# EAGLE design main_new_layout (EAGLE 9.6.2)
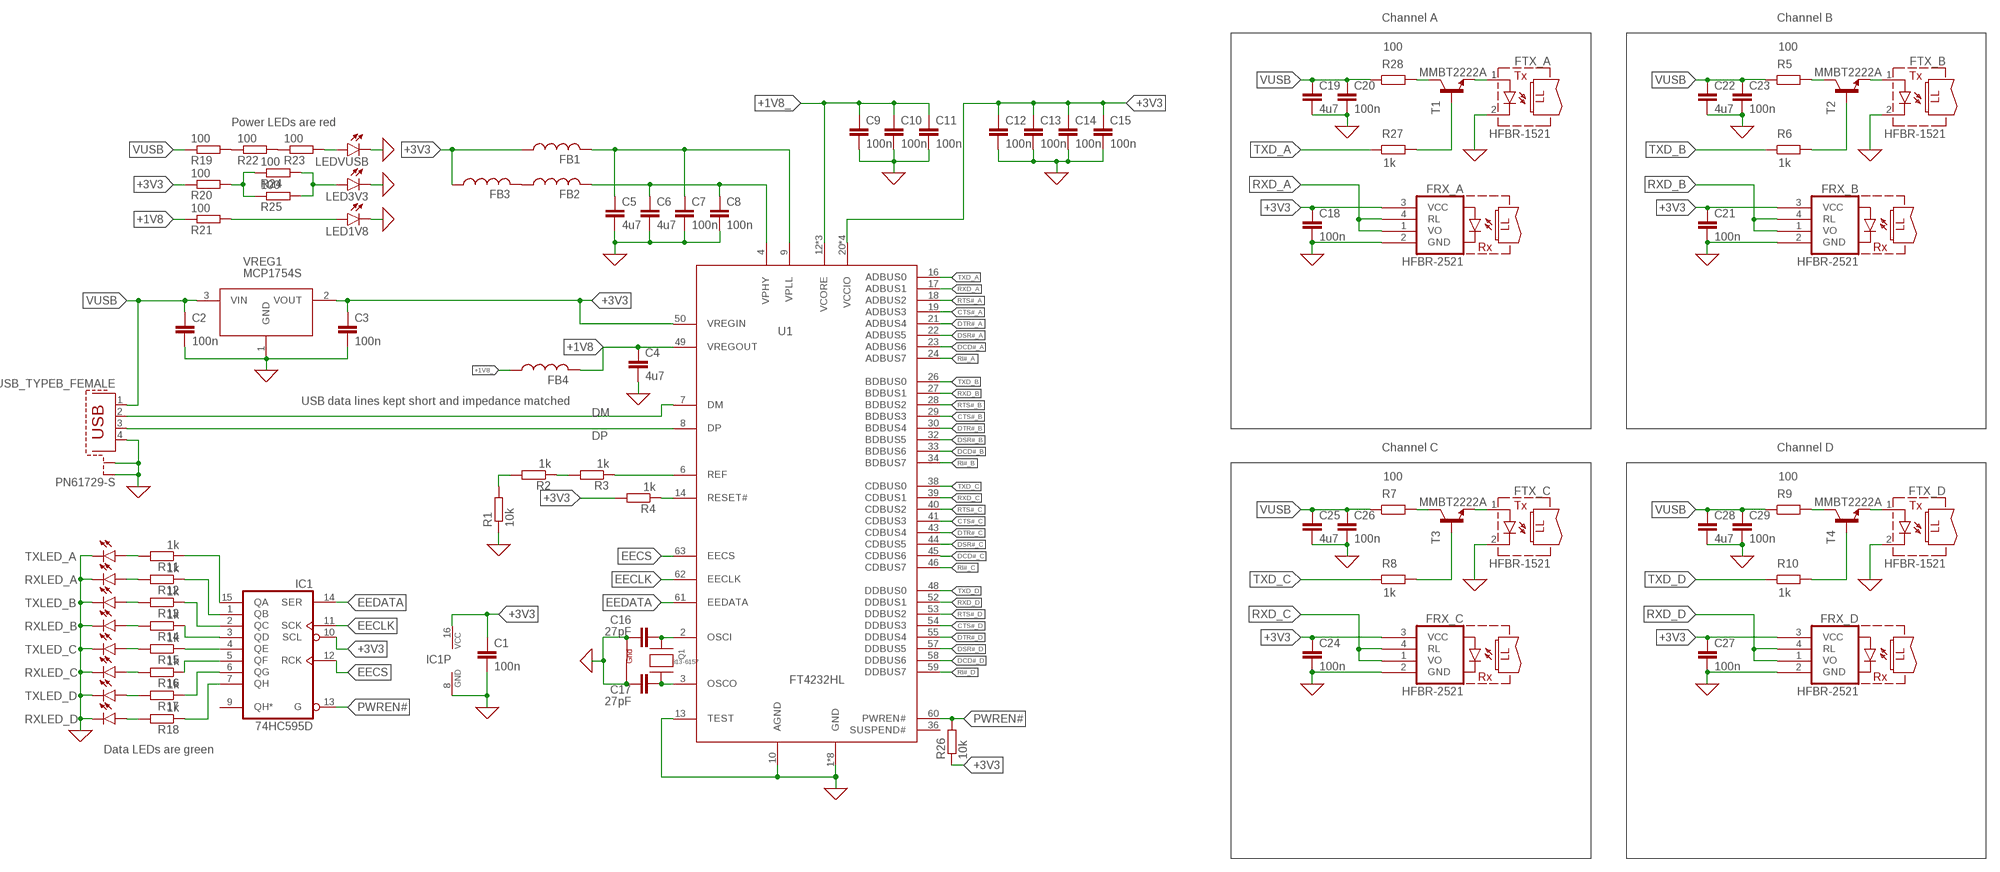
[diagram p0: schematic, sheet 1]

## Parts
C1  100n  C-EUC0805  [C0805]
C2  100n  C-EUC0805  [C0805]
C3  100n  C-EUC0805  [C0805]
C4  4u7  C-EUC0805  [C0805]
C5  4u7  C-EUC0805  [C0805]
C6  4u7  C-EUC0805  [C0805]
C7  100n  C-EUC0805  [C0805]
C8  100n  C-EUC0805  [C0805]
C9  100n  C-EUC0805  [C0805]
C10  100n  C-EUC0805  [C0805]
C11  100n  C-EUC0805  [C0805]
C12  100n  C-EUC0805  [C0805]
C13  100n  C-EUC0805  [C0805]
C14  100n  C-EUC0805  [C0805]
C15  100n  C-EUC0805  [C0805]
C16  27pF  C-EUC0805  [C0805]
C17  27pF  C-EUC0805  [C0805]
C18  100n  C-EUC0805  [C0805]
C19  4u7  C-EUC0805  [C0805]
C20  100n  C-EUC0805  [C0805]
C21  100n  C-EUC0805  [C0805]
C22  4u7  C-EUC0805  [C0805]
C23  100n  C-EUC0805  [C0805]
C24  100n  C-EUC0805  [C0805]
C25  4u7  C-EUC0805  [C0805]
C26  100n  C-EUC0805  [C0805]
C27  100n  C-EUC0805  [C0805]
C28  4u7  C-EUC0805  [C0805]
C29  100n  C-EUC0805  [C0805]
FB1  FERRITE  [R0805]
FB2  FERRITE  [R0805]
FB3  FERRITE  [R0805]
FB4  FERRITE  [R0805]
FRX_A  HFBR-2521  [HFBR-15X3]
FRX_B  HFBR-2521  [HFBR-15X3]
FRX_C  HFBR-2521  [HFBR-15X3]
FRX_D  HFBR-2521  [HFBR-15X3]
FTX_A  HFBR-1521  [HFBR-15X3]
FTX_B  HFBR-1521  [HFBR-15X3]
FTX_C  HFBR-1521  [HFBR-15X3]
FTX_D  HFBR-1521  [HFBR-15X3]
IC1  74HC595D  [SO16]
LED1V8  LEDCHIP-LED0805  [CHIP-LED0805]
LED3V3  LEDCHIP-LED0805  [CHIP-LED0805]
LEDVUSB  LEDCHIP-LED0805  [CHIP-LED0805]
Q1  XTAL-4-3225  [NX3225]
R1  10k  R-EU_R0805  [R0805]
R2  1k  R-EU_R0805  [R0805]
R3  1k  R-EU_R0805  [R0805]
R4  1k  R-EU_R0805  [R0805]
R5  100  R-EU_R0805  [R0805]
R6  1k  R-EU_R0805  [R0805]
R7  100  R-EU_R0805  [R0805]
R8  1k  R-EU_R0805  [R0805]
R9  100  R-EU_R0805  [R0805]
R10  1k  R-EU_R0805  [R0805]
R11  1k  R-EU_R0805  [R0805]
R12  1k  R-EU_R0805  [R0805]
R13  1k  R-EU_R0805  [R0805]
R14  1k  R-EU_R0805  [R0805]
R15  1k  R-EU_R0805  [R0805]
R16  1k  R-EU_R0805  [R0805]
R17  1k  R-EU_R0805  [R0805]
R18  1k  R-EU_R0805  [R0805]
R19  100  R-EU_R0805  [R0805]
R20  100  R-EU_R0805  [R0805]
R21  100  R-EU_R0805  [R0805]
R22  100  R-EU_R0805  [R0805]
R23  100  R-EU_R0805  [R0805]
R24  100  R-EU_R0805  [R0805]
R25  100  R-EU_R0805  [R0805]
R26  10k  R-EU_R0805  [R0805]
R27  1k  R-EU_R0805  [R0805]
R28  100  R-EU_R0805  [R0805]
RXLED_A  LEDCHIP-LED0805  [CHIP-LED0805]
RXLED_B  LEDCHIP-LED0805  [CHIP-LED0805]
RXLED_C  LEDCHIP-LED0805  [CHIP-LED0805]
RXLED_D  LEDCHIP-LED0805  [CHIP-LED0805]
T1  MMBT2222A  BC847A-NPN-SOT23-BEC  [SOT23-BEC]
T2  MMBT2222A  BC847A-NPN-SOT23-BEC  [SOT23-BEC]
T3  MMBT2222A  BC847A-NPN-SOT23-BEC  [SOT23-BEC]
T4  MMBT2222A  BC847A-NPN-SOT23-BEC  [SOT23-BEC]
TXLED_A  LEDCHIP-LED0805  [CHIP-LED0805]
TXLED_B  LEDCHIP-LED0805  [CHIP-LED0805]
TXLED_C  LEDCHIP-LED0805  [CHIP-LED0805]
TXLED_D  LEDCHIP-LED0805  [CHIP-LED0805]
U1  FT4232HL  [LQFP-ST-64-2]
USB_TYPEB_FEMALE  PN61729-S  [PN61729-S]
VREG1  MCP1754S  [SOT23]

## Nets
0: C1.2 C2.2 C3.2 C4.2 C5.2 C6.2 C7.2 C8.2 C9.2 C10.2 C11.2 C12.2 C13.2 C14.2 C15.2 C16.2 C17.2 C18.2 C19.2 C20.2 C21.2 C22.2 C23.2 C24.2 C25.2 C26.2 C27.2 C28.2 C29.2 FRX_A.2(GND) FRX_B.2(GND) FRX_C.2(GND) FRX_D.2(GND) FTX_A.2(C) FTX_B.2(C) FTX_C.2(C) FTX_D.2(C) IC1.8(GND) LED1V8.C LED3V3.C LEDVUSB.C Q1.2(G2) Q1.4(G1) R1.1 RXLED_A.C RXLED_B.C RXLED_C.C RXLED_D.C TXLED_A.C TXLED_B.C TXLED_C.C TXLED_D.C U1.1(GND) U1.5(GND) U1.10(AGND) U1.11(GND) U1.13(TEST) U1.15(GND) U1.25(GND) U1.35(GND) U1.47(GND) U1.51(GND) USB_TYPEB_FEMALE.4 USB_TYPEB_FEMALE.S1 USB_TYPEB_FEMALE.S2 VREG1.1(GND) ; supply symbol labelled GND
+1V8: C4.1 FB4.2 R21.1 U1.49(VREGOUT)
+1V8_: C9.1 C10.1 C11.1 FB4.1 U1.12(VCORE) U1.37(VCORE) U1.64(VCORE)
+3V3: C1.1 C3.1 C12.1 C13.1 C14.1 C15.1 C18.1 C21.1 C24.1 C27.1 FB1.1 FB3.1 FRX_A.3(VCC) FRX_B.3(VCC) FRX_C.3(VCC) FRX_D.3(VCC) IC1.10(SCL) IC1.16(VCC) R4.2 R20.1 R26.1 U1.20(VCCIO) U1.31(VCCIO) U1.42(VCCIO) U1.50(VREGIN) U1.56(VCCIO) VREG1.2(VOUT)
CTS#_A: U1.19(ADBUS3)
CTS#_B: U1.29(BDBUS3)
CTS#_C: U1.41(CDBUS3)
CTS#_D: U1.54(DDBUS3)
DCD#_A: U1.23(ADBUS6)
DCD#_B: U1.33(BDBUS6)
DCD#_C: U1.45(CDBUS6)
DCD#_D: U1.58(DDBUS6)
DM: U1.7(DM) USB_TYPEB_FEMALE.2
DP: U1.8(DP) USB_TYPEB_FEMALE.3
DSR#_A: U1.22(ADBUS5)
DSR#_B: U1.32(BDBUS5)
DSR#_C: U1.44(CDBUS5)
DSR#_D: U1.57(DDBUS5)
DTR#_A: U1.21(ADBUS4)
DTR#_B: U1.30(BDBUS4)
DTR#_C: U1.43(CDBUS4)
DTR#_D: U1.55(DDBUS4)
EECLK: IC1.11(SCK) U1.62(EECLK)
EECS: IC1.12(RCK) U1.63(EECS)
EEDATA: IC1.14(SER) U1.61(EEDATA)
N$1: LEDVUSB.A R23.2
N$2: LED3V3.A R24.2 R25.2
N$3: R27.2 T1.B
N$4: C5.1 C7.1 FB1.2 U1.9(VPLL)
N$5: C6.1 C8.1 FB2.2 U1.4(VPHY)
N$6: R28.2 T1.C
N$7: C17.1 Q1.3(X2) U1.3(OSCO)
N$8: C16.1 Q1.1(X1) U1.2(OSCI)
N$9: R3.1 U1.6(REF)
N$10: R4.1 U1.14(RESET#)
N$11: R2.1 R3.2
N$12: R1.2 R2.2
N$13: R6.2 T2.B
N$14: R5.2 T2.C
N$15: FTX_B.1(A) T2.E
N$16: FTX_A.1(A) T1.E
N$17: R8.2 T3.B
N$18: R7.2 T3.C
N$19: FTX_C.1(A) T3.E
N$20: R10.2 T4.B
N$21: R9.2 T4.C
N$22: FTX_D.1(A) T4.E
N$23: FB2.1 FB3.2
N$27: IC1.15(QA) R11.1
N$28: IC1.1(QB) R12.1
N$29: IC1.2(QC) R13.1
N$30: LED1V8.A R21.2
N$33: IC1.3(QD) R14.1
N$34: IC1.4(QE) R15.1
N$35: IC1.5(QF) R16.1
N$36: IC1.6(QG) R17.1
N$37: IC1.7(QH) R18.1
N$38: R19.2 R22.1
N$39: R11.2 TXLED_A.A
N$40: R12.2 RXLED_A.A
N$41: R13.2 TXLED_B.A
N$42: R14.2 RXLED_B.A
N$43: R15.2 TXLED_C.A
N$44: R16.2 RXLED_C.A
N$45: R17.2 TXLED_D.A
N$46: R18.2 RXLED_D.A
N$47: R22.2 R23.1
N$48: R20.2 R24.1 R25.1
PWREN#: IC1.13(G) R26.2 U1.60(PWREN#)
RI#_A: U1.24(ADBUS7)
RI#_B: U1.34(BDBUS7)
RI#_C: U1.46(CDBUS7)
RI#_D: U1.59(DDBUS7)
RTS#_A: U1.18(ADBUS2)
RTS#_B: U1.28(BDBUS2)
RTS#_C: U1.40(CDBUS2)
RTS#_D: U1.53(DDBUS2)
RXD_A: FRX_A.1(VO) FRX_A.4(RL) U1.17(ADBUS1)
RXD_B: FRX_B.1(VO) FRX_B.4(RL) U1.27(BDBUS1)
RXD_C: FRX_C.1(VO) FRX_C.4(RL) U1.39(CDBUS1)
RXD_D: FRX_D.1(VO) FRX_D.4(RL) U1.52(DDBUS1)
TXD_A: R27.1 U1.16(ADBUS0)
TXD_B: R6.1 U1.26(BDBUS0)
TXD_C: R8.1 U1.38(CDBUS0)
TXD_D: R10.1 U1.48(DDBUS0)
VUSB: C2.1 C19.1 C20.1 C22.1 C23.1 C25.1 C26.1 C28.1 C29.1 R5.1 R7.1 R9.1 R19.1 R28.1 USB_TYPEB_FEMALE.1 VREG1.3(VIN)
Unconnected: IC1.9(QH*) U1.36(SUSPEND#)

## Notes on the sheet
- Channel A | Channel B
- Power LEDs are red
- USB data lines kept short and impedance matched
- Channel C | Channel D
- 813-6157
- Data LEDs are green

## Library data of the parts
C1-C29 = rcl:C-EU: CAPACITOR, European symbol; SPICEPREFIX: C
FB1-FB4 = josh:FERRITE: Ferrite Bead 0805 FB
FRX_A FRX_B FRX_C FRX_D = fiber-optic-hp_modified:HFBR-2521: RECEIVER 5-MBd high performance link, horizontal; MF: AGILENT TECHNOLOGIES; MPN: HFBR-2521; OC_FARNELL: 1173131; OC_NEWARK: 06F6091
FTX_A FTX_B FTX_C FTX_D = fiber-optic-hp_modified:HFBR-1521: TRANSMITTER low cost miniature fiber optic component, 5-MBd high performance link, vertical; MF: AGILENT TECHNOLOGIES; MPN: HFBR-1521; OC_FARNELL: 1173128; OC_NEWARK: 06F6050
IC1 = 74xx-eu:74*595: 8-bit SHIFT REGISTER, output latch
LED1V8 LED3V3 LEDVUSB RXLED_A RXLED_B RXLED_C RXLED_D TXLED_A TXLED_B TXLED_C TXLED_D = led:LED: LED OSRAM: - CHIPLED LG R971, LG N971, LY N971, LG Q971, LY Q971, LO R971, LY R971 LH N974, LH R974 LS Q976, LO Q976, LY Q976 LO Q996 - Hyper CHIPLED LW Q18S LB Q993, LB Q99A, LB R99A - SideLED LS A670, LO A670, LY A670, LG A670, LP A670 LB A673, LV A673, LT A673, LW A673 LH A674 LY A675 LS A676, LA A676, LO A676, LY A676, LW A676 LS A679, LY A679, LG A679 - Hyper Micro SIDELED® LS Y876, LA Y876, LO Y876, LY Y876 LT Y87S - SmartLED LW L88C, LW L88S LB L89C, LB L89S, LG L890 LS L89K, LO L89K, LY L89K LS L896, LA L896, LO L896, LY L896 - TOPLED LS T670, LO T670, LY T670, LG T670, LP T670 LSG T670, LSP T670, LSY T670, LOP T670, LYG T670 LG T671, LOG T671, LSG T671 LB T673, LV T673, LT T673, LW T673 LH T674 LS T676, LA T676, LO T676, LY T676, LB T676, LH T676, LSB T676, LW T676 LB T67C, LV T67C, LT T67C, LS T67K, LO T67K, LY T67K, LW E67C LS E67B, LA E67B, LO E67B, LY E67B, LB E67C, LV E67C, LT E67C LW T67C LS T679, LY T679, LG T679 LS T770, LO T770, LY T770, LG T770, LP T770 LB T773, LV T773, LT T773, LW T773 LH T774 LS E675, LA E675, LY E675, LS T675 LS T776, LA T776, LO T776, LY T776, LB T776 LHGB T686 LT T68C, LB T68C - Hyper Mini TOPLED® LB M676 - Mini TOPLED Santana® LG M470 LS M47K, LO M47K, LY M47K Source: http://www.osram.convergy.de LUXEON: - LUMILED® LXK2-PW12-R00, LXK2-PW12-S00, LXK2-PW14-U00, LXK2-PW14-V00 LXK2-PM12-R00, LXK2-PM12-S00, LXK2-PM14-U00 LXK2-PE12-Q00, LXK2-PE12-R00, LXK2-PE12-S00, LXK2-PE14-T00, LXK2-PE14-U00 LXK2-PB12-K00, LXK2-PB12-L00, LXK2-PB12-M00, LXK2-PB14-N00, LXK2-PB14-P00, LXK2-PB14-Q00 LXK2-PR12-L00, LXK2-PR12-M00, LXK2-PR14-Q00, LXK2-PR14-R00 LXK2-PD12-Q00, LXK2-PD12-R00, LXK2-PD12-S00 LXK2-PH12-R00, LXK2-PH12-S00 LXK2-PL12-P00, LXK2-PL12-Q00, LXK2-PL12-R00 Source: www.luxeon.com KINGBRIGHT: KA-3528ASYC Source: www.kingbright.com
Q1 = adafruit:XTAL-4: Classic 4-pin 3.2 x 2.5mm crystal
R1-R28 = rcl:R-EU_: RESISTOR, European symbol; SPICEPREFIX: R
T1-T4 = transistor:*-NPN-: NPN Transistror BF959 corrected 2008.03.06
U1 = josh:FT4232HL: FT4232HL USB Interface IC USB HS to Quad UART/ SPI/JTAG/I2C LQFP-64
USB_TYPEB_FEMALE = con-berg:PN61729-S: BERG USB connector; OC_FARNELL: unknown; OC_NEWARK: unknown
VREG1 = josh:MCP1754S: 3.3V 3V3 Voltage Regulator

## Board
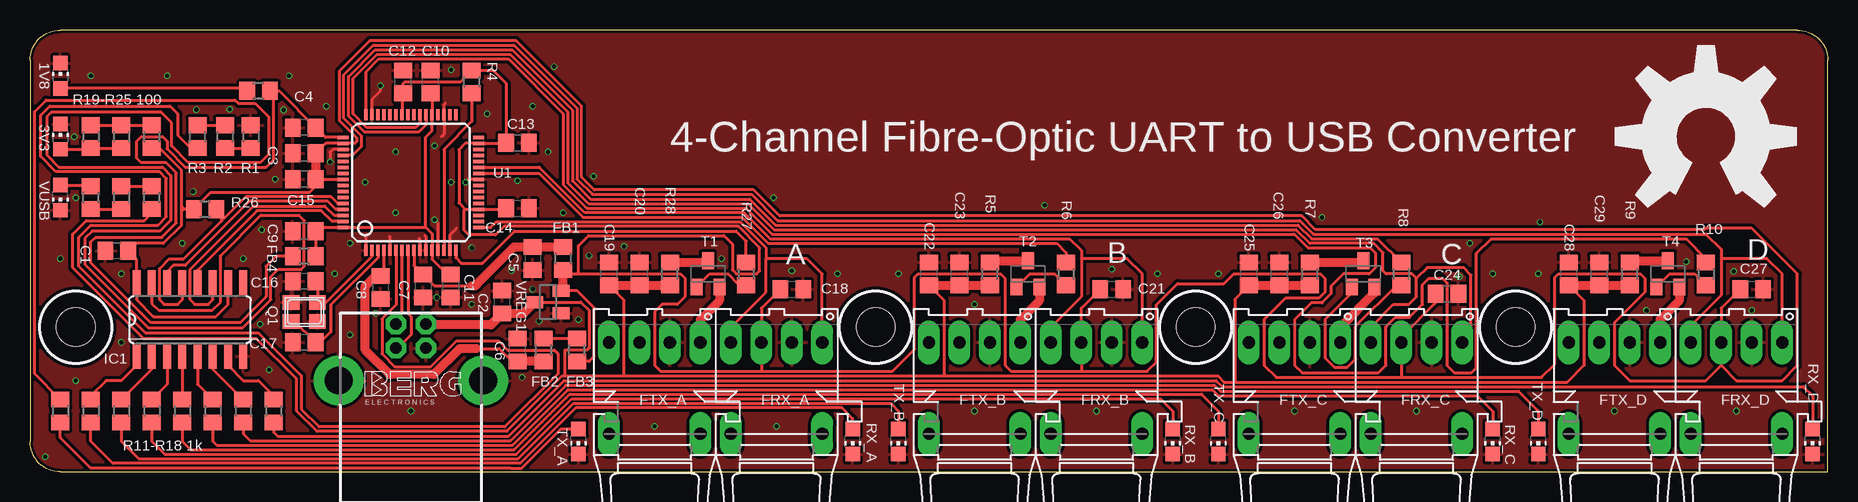
[diagram p1: board, top side]
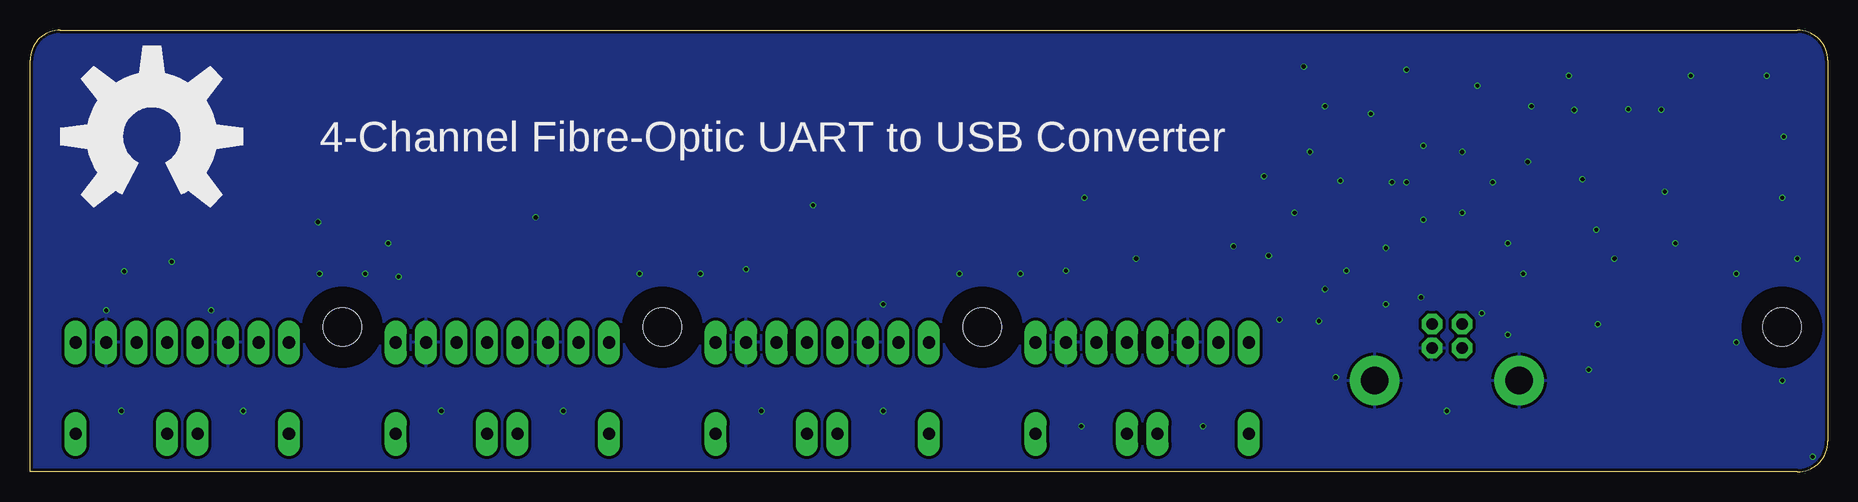
[diagram p2: board, bottom side, seen from below]

Size 149.86 x 36.83 mm. Coordinates in mm from the lower left corner, seen from the top.
Outline: 2.54,0 149.86,0 149.86,34.29 arc90 147.32,36.83 2.54,36.83 arc90 0,34.29 0,2.54 arc90 2.54,0
Copper layers (1*16): Top 0.035mm / dielectric 1.6mm / Bottom 0.035mm
Design rules "jlcpcb-2layers": minimum track width 5mil, minimum drill 0.3mm, track to track 5mil, track to pad 5mil, pad to pad 5mil, via to via 5mil, smd to smd 5mil, copper to edge 0.2mm, drill to drill 6mil, minimum pad ring 10mil, minimum via ring 3mil, stop-mask expansion 4mil, vias tented up to drill 0mil, thermal gap 10mil
Holes 3.2 mm at 3.81,12.06 70.48,12.06 97.16,12.06 123.83,12.06
tRestrict: area 0.8,9.1 to 6.8,15; area 67.5,9.1 to 73.5,15; area 94.2,9.1 to 100.1,15; area 120.8,9.1 to 126.8,15
bRestrict: area 120.8,9.1 to 126.8,15; area 94.2,9.1 to 100.1,15; area 67.5,9.1 to 73.5,15; area 0.8,9.1 to 6.8,15

### Footprints (pad centres in the part's own frame; a part is rotated, then mirrored left to right if it is on the bottom)
C0805 = smd 1.3 x 1.5: 1 -0.95,0; 2 0.95,0
R0805 = smd 1.3 x 1.5: 1 -0.95,0; 2 0.95,0
HFBR-15X3 = drill 1.016 long: 1 3.81,9.525; 2 1.27,9.525; 3 -1.27,9.525; 4 -3.81,9.525; 5 -3.81,1.905; 8 3.81,1.905
SO16 = smd 0.66 x 2.032: 1 -4.445,-3.073; 2 -3.175,-3.073; 3 -1.905,-3.073; 4 -0.635,-3.073; 5 0.635,-3.073; 6 1.905,-3.073; 7 3.175,-3.073; 8 4.445,-3.073; 9 4.445,3.073; 10 3.175,3.073; 11 1.905,3.073; 12 0.635,3.073; 13 -0.635,3.073; 14 -1.905,3.073; 15 -3.175,3.073; 16 -4.445,3.073
CHIP-LED0805 = smd 1.2 x 1.2: A 0,-1.05; C 0,1.05
NX3225 = smd 1.4 x 1.2: 1 -1.1,-0.8; 2 1.1,-0.8; 3 1.1,0.8; 4 -1.1,0.8
SOT23-BEC = smd 1 x 1.4: B -0.95,-1.1; C 0,1.1; E 0.95,-1.1
LQFP-ST-64-2 = smd 0.9 x 0.3: 1 -5.65,3.75; 2 -5.65,3.25; 3 -5.65,2.75; 4 -5.65,2.25; 5 -5.65,1.75; 6 -5.65,1.25; 7 -5.65,0.75; 8 -5.65,0.25; 9 -5.65,-0.25; 10 -5.65,-0.75; 11 -5.65,-1.25; 12 -5.65,-1.75; 13 -5.65,-2.25; 14 -5.65,-2.75; 15 -5.65,-3.25; 16 -5.65,-3.75; 33 5.65,-3.75; 34 5.65,-3.25; 35 5.65,-2.75; 36 5.65,-2.25; 37 5.65,-1.75; 38 5.65,-1.25; 39 5.65,-0.75; 40 5.65,-0.25; 41 5.65,0.25; 42 5.65,0.75; 43 5.65,1.25; 44 5.65,1.75; 45 5.65,2.25; 46 5.65,2.75; 47 5.65,3.25; 48 5.65,3.75 | smd 0.3 x 0.9: 17 -3.75,-5.65; 18 -3.25,-5.65; 19 -2.75,-5.65; 20 -2.25,-5.65; 21 -1.75,-5.65; 22 -1.25,-5.65; 23 -0.75,-5.65; 24 -0.25,-5.65; 25 0.25,-5.65; 26 0.75,-5.65; 27 1.25,-5.65; 28 1.75,-5.65; 29 2.25,-5.65; 30 2.75,-5.65; 31 3.25,-5.65; 32 3.75,-5.65; 49 3.75,5.65; 50 3.25,5.65; 51 2.75,5.65; 52 2.25,5.65; 53 1.75,5.65; 54 1.25,5.65; 55 0.75,5.65; 56 0.25,5.65; 57 -0.25,5.65; 58 -0.75,5.65; 59 -1.25,5.65; 60 -1.75,5.65; 61 -2.25,5.65; 62 -2.75,5.65; 63 -3.25,5.65; 64 -3.75,5.65
PN61729-S = drill 0.95 octagon: 1 1.25,4.71; 2 -1.25,4.71; 3 -1.25,2.71; 4 1.25,2.71 | drill 2.3 pad 2.9: S1 -6.02,0; S2 6.02,0
SOT23 = smd 1 x 1.4: 1 -0.95,-1.1; 2 0.95,-1.1; 3 0,1.1

### Placement (x,y rotation side)
C1  7.24,18.41 180 top
C2  39.37,14.16 90 top
C3  22.86,26.54 180 top
C4  22.86,28.7 180 top
C5  41.91,17.78 270 top
C6  40.64,10.16 90 top
C7  32.77,15.49 270 top
C8  29.21,15.37 270 top
C9  22.86,20.07 180 top
C10  33.4,32.51 90 top
C11  35.05,15.49 270 top
C12  31.11,32.51 90 top
C13  40.64,27.43 0 top
C14  40.64,21.97 0 top
C15  22.86,24.38 180 top
C16  22.86,15.88 180 top
C17  22.86,10.79 180 top
C18  63.5,15.24 0 top
C19  48.26,16.51 90 top
C20  50.8,16.51 90 top
C21  90.17,15.24 0 top
C22  74.93,16.51 90 top
C23  77.47,16.51 90 top
C24  118.11,14.86 0 top
C25  101.6,16.51 90 top
C26  104.14,16.51 90 top
C27  143.51,15.24 0 top
C28  128.27,16.51 90 top
C29  130.81,16.51 90 top
FB1  44.45,17.78 90 top
FB2  42.8,10.16 270 top
FB3  45.59,10.16 90 top
FB4  22.86,17.97 180 top
FRX_A  62.23,1.27 0 top
FRX_B  88.9,1.27 0 top
FRX_C  115.57,1.27 0 top
FRX_D  142.24,1.27 0 top
FTX_A  52.07,1.27 0 top
FTX_B  78.74,1.27 0 top
FTX_C  105.41,1.27 0 top
FTX_D  132.08,1.27 0 top
IC1  13.34,12.7 0 top
LED1V8  2.54,33.02 0 top
LED3V3  2.54,27.94 0 top
LEDVUSB  2.54,22.86 180 top
Q1  22.86,13.34 180 top
R1  18.41,27.94 270 top
R2  16.26,27.94 270 top
R3  13.97,27.94 90 top
R4  36.83,32.51 90 top
R5  80.01,16.51 90 top
R6  86.36,16.51 270 top
R7  106.68,16.51 90 top
R8  114.3,16.51 270 top
R9  133.35,16.51 90 top
R10  139.7,16.51 270 top
R11  2.54,5.08 270 top
R12  5.08,5.08 270 top
R13  7.62,5.08 270 top
R14  10.16,5.08 270 top
R15  12.7,5.08 270 top
R16  15.24,5.08 270 top
R17  17.78,5.08 270 top
R18  20.32,5.08 270 top
R19  10.16,22.86 90 top
R20  10.16,27.94 90 top
R21  19.05,31.75 180 top
R22  7.62,22.86 270 top
R23  5.08,22.86 90 top
R24  5.08,27.94 270 top
R25  7.62,27.94 270 top
R26  14.61,21.91 0 top
R27  59.69,16.51 270 top
R28  53.34,16.51 90 top
RXLED_A  68.58,2.54 180 top
RXLED_B  95.25,2.54 180 top
RXLED_C  121.92,2.54 180 top
RXLED_D  148.59,2.54 180 top
T1  56.52,16.51 0 top
T2  83.19,16.51 0 top
T3  111.12,16.51 0 top
T4  136.53,16.51 0 top
TXLED_A  45.72,2.54 180 top
TXLED_B  72.39,2.54 180 top
TXLED_C  99.06,2.54 180 top
TXLED_D  125.73,2.54 180 top
U1  31.75,24.13 90 top
USB_TYPEB_FEMALE  31.75,7.62 0 top
VREG1  43.18,14.16 90 top

### Tracks (layer width: path | path; a pad name or v marks a point on that pad's centre or on a via)
0  (via drill 0.35)
  Top 0.254: 34.29,27.94 34.5,28.15 U1.35 34.5,30.59 34.65,30.73 | U1.25 36.57,24.38 v36.32,24.13 | U1.10 32.5,19.39 32.44,19.46 | U1.13 34,20.74 v33.72,21.02 | U1.11 33,19.6 32.92,19.68 | U1.15 35,19.76 35.56,20.32 | U1.1 28,19.75 28.04,19.79 | U1.5 30,19.61 29.97,19.63 | U1.51 25.25,26.88 25.02,26.64 v25.02,25.83 | U1.47 28.5,31.04 29.21,31.75 v29.21,32.19
  other vias: 30.48,26.67 30.48,21.59 35.12,24.13 44.45,21.59 40.64,24.26 43.18,26.67 41.91,30.48 35.12,33.53 33.72,27.18 36.83,18.67 24.7,30.48 27.94,24.13 20.45,24.38 13.59,23.37 21.15,30.16 21.59,33.02 11.43,33.02 5.08,33.02 3.68,27.94 3.81,22.86 2.54,17.78 12.7,19.05 7.62,16.51 7.62,10.79 19.3,20.19 17.78,17.78 19.18,12.32 25.4,16.51 26.67,19.05 33.91,14.54 36.83,13.97 26.67,11.43 31.75,5.08 19.94,8.51 3.81,7.62 1.27,1.27 41.02,7.87 42.42,12.57 45.72,12.7 40.13,16.76 41.91,15.24 46.61,18.03 49.53,18.8 57.66,17.78 63.5,16.76 67.31,16.51 72.39,16.51 46.99,24.64 43.69,33.78 61.98,22.86 38.1,29.84 107.7,21.21 84.58,22.23 125.86,20.83 120.02,19.05 119.13,16.26 78.74,13.97 90.17,16.89 93.98,16.51 99.06,16.51 121.92,16.51 125.73,16.51 138.05,17.53 134.75,13.46 143.51,13.46 142.24,5.08 132.08,5.08 115.57,5.08 105.41,5.08 78.74,5.08 88.9,5.08 52.07,3.81 62.23,3.81 142.01,16.71 28.83,13.23 13.87,30.2 16.64,30.23
  pour Top (isolate 0.254): -1.27,-1.27 -1.27,38.1 151.13,38.1 151.13,-1.27
  pour Bottom (isolate 0.254): -2.54,-2.54 -2.54,39.37 152.4,39.37 152.4,-2.54
+1V8
  Top 0.254: U1.49 24.63,27.88 C4.1 20.76,31.75 20.32,31.75 | R21.1 20.32,31.75 | 20.32,31.75 20.32,26.04 19.68,25.4 12.95,25.4 11.43,26.92 11.43,27.56 11.05,27.94 9.27,27.94 8.89,27.56 8.89,26.16 9.27,25.78 11.33,25.78 12.19,24.92 12.19,20.77 10.99,19.56 5.46,19.56 5.08,19.18 5.08,17.43 10.06,12.45 17.53,12.45 19.68,14.61 19.68,17.14 20.51,17.97 FB4.2
+1V8_
  Top 0.254: C11.1 34.8,16.44 33.5,17.74 U1.12 33.5,19.84 32.96,20.38 | C10.1 33.5,31.46 U1.37 33.5,28.42 32.96,27.88 32.96,20.38 | 32.96,20.38 U1.64 24.12,20.38 C9.1 FB4.1
+3V3
  Top 0.254: IC1.10 16.51,13.97 15.49,12.95 10.29,12.95 8.89,14.35 IC1.16 8.89,17.71 C1.1 8.82,19.05 11.11,19.05 12.64,20.57 12.64,21.72 | U1.56 C15.1 23.88,24.38 24.13,24.13 23.3,23.3 15.05,23.3 R26.1 12.83,21.91 | C3.1 24.65,27.38 U1.50 27.06,27.38 27.24,27.56 27.24,27.85 25.78,29.31 25.78,33.4 28.32,35.94 40.51,35.94 45.97,30.48 45.97,24.57 47.04,23.51 60.31,23.51 62.48,21.34 106.01,21.34 107.15,20.19 139.57,20.19 139.7,20.32 143.51,20.32 147.32,16.51 147.32,8.89 146.05,7.62 142.24,7.62 140.97,8.89 | U1.42 31,31.45 C12.1 31.11,32.38 31.24,32.51 35.88,32.51 R4.2 38.61,33.46 39.69,32.38 C13.1 39.64,27.38 U1.31 36.27,27.38 35.75,26.86 35.75,22.42 36.29,21.88 | C14.1 39.6,21.88 U1.20 36.29,21.88 | R20.1 10.79,26.99 12.64,25.15 12.64,22.1 | 62.23,15.56 C18.1 60.96,13.65 FRX_A.3 | 88.9,15.56 C21.1 87.63,13.65 FRX_B.3 87.63,8.38 | 116.84,15.18 C24.1 117.16,14.1 114.3,11.24 FRX_C.3 114.3,7.87 | 142.24,15.56 C27.1 140.97,13.65 FRX_D.3 140.97,8.89 | FB1.1 44.77,16.51 45.72,16.51 | 45.72,16.51 54.23,16.51 54.61,16.13 54.61,14.61 53.98,13.97 52.7,13.97 52.07,13.34 52.07,8.89 52.58,8.38 60.96,8.38 | 60.96,10.16 FRX_A.3 | 60.96,8.38 71.88,8.38 73.74,10.24 73.74,16.2 74.04,16.51 80.9,16.51 81.28,16.13 81.28,8.89 81.79,8.38 87.63,8.38 | 87.63,8.38 93.12,8.38 93.88,9.14 93.88,13.92 95.66,15.7 99.52,15.7 100.33,16.52 107.56,16.52 107.95,16.13 107.95,14.99 107.44,14.48 104.65,14.48 102.87,12.7 102.87,8.89 103.89,7.87 114.3,7.87 | 114.3,7.87 125.98,7.87 127.1,8.99 127.1,16.2 127.41,16.51 134.24,16.51 134.62,16.13 134.62,14.99 132.08,12.45 132.08,8.89 133.35,7.62 139.7,7.62 140.97,8.89
  Top 0.254: 45.72,16.51 45.72,18.86 46.55,19.68 57.85,19.68 58.55,18.99 58.55,16.84 58.88,16.51 60.58,16.51 60.83,16.76 60.83,18.67 59.05,20.46 39.51,20.46 38.8,19.75 36.58,19.75 36.2,20.13 36.2,21.79 36.29,21.88 | FRX_A.3 60.96,8.38 | FB3.1 46.61,9.21 47.03,9.63 47.03,13.68 45.6,15.11 VREG1.2 | 12.64,21.72 12.64,22.1 | 12.83,21.91 12.64,22.1 | 12.83,21.91 12.64,21.72
  Top 0.762: VREG1.2 44.45,15.28 FB1.1 | C3.1 C15.1
DM
  Top 0.254: USB_TYPEB_FEMALE.2 30.5,12.72 31,13.22 U1.7
DP
  Top 0.254: U1.8 31.5,13.2 31.75,12.95 31.75,11.43 30.65,10.33 USB_TYPEB_FEMALE.3
EECLK
  Top 0.254: IC1.11 15.24,14.35 14.86,13.97 13.72,13.97 13.34,14.35 13.34,16.89 18.61,22.16 24.57,22.16 25.36,21.38 U1.62
EECS
  Top 0.254: IC1.12 13.97,16.83 18.92,21.78 24.29,21.78 25.19,20.88 U1.63
EEDATA
  Top 0.254: U1.61 25.49,21.88 24.83,22.54 18.29,22.54 12.95,17.21 11.94,17.21 11.43,16.7 IC1.14 11.58,15.77
N$1
  Top 0.254: LEDVUSB.A 4.98,23.91 R23.2
N$2
  Top 0.254: R25.2 R24.2 4.98,26.89 LED3V3.A
N$3
  Top 0.254: T1.B 56.66,16.51 58.17,16.51 59.12,15.56 R27.2
N$4
  Top 0.254: U1.9 32,17.21 C7.1 33.72,15.49 36.83,15.49
  Top 0.762: FB1.2 C5.1 40.32,18.73 37.47,15.88 | 36.83,15.49 37.08,15.49 37.47,15.88 | 37.47,15.88
N$5
  Top 0.254: C8.1 29.18,16.34 | 29.5,16.66 U1.4 | 36.83,10.29 39.12,10.29 40.19,9.21 C6.1
  Top 0.762: FB2.2 C6.1 | 37.21,10.29 36.83,10.29 35.81,10.29 33.66,8.13 29.97,8.13 27.94,10.16 27.94,15.48 28.77,16.32 C8.1 | 29.18,16.34 29.5,16.66
N$6
  Top 0.762: R28.2 56.37,17.46 T1.C
N$7
  Top 0.254: Q1.3 22.07,12.54 C17.1 24.19,10.79 25.08,11.68 25.08,13.95 29,17.87 U1.3
N$8
  Top 0.254: C16.1 23.96,15.72 Q1.1 24.68,14.13 28.5,17.96 U1.2
N$9
  Top 0.254: R3.1 13.4,26.99 12.32,28.07 12.32,29.84 11.68,30.48 1.65,30.48 0.89,29.72 0.89,26.29 2.16,25.02 10.79,25.02 11.37,24.45 11.37,21.27 10.67,20.57 5.08,20.57 4.06,19.56 4.06,17.14 9.65,11.56 19.08,11.56 22.61,8.03 22.61,5.24 24.09,3.76 39.58,3.76 44.01,8.18 44.01,9.84 43.69,10.16 39.81,10.16 39.05,10.92 35.55,10.92 33.39,8.76 30.42,8.76 29.34,9.84 29.34,12.76 30.5,13.93 U1.6
N$10
  Top 0.254: R4.1 36.83,29.21 34.5,26.88 U1.14
N$11
  Top 0.254: R3.2 R2.1
N$12
  Top 0.254: R2.2 R1.2
N$13
  Top 0.254: T2.B 83.33,16.51 85.41,16.51 R6.2
N$14
  Top 0.762: R5.2 80.16,17.61 T2.C
N$15
  Top 0.762: T2.E 84.14,14.29 82.55,12.7 FTX_B.1
N$16
  Top 0.762: T1.E 57.47,14.29 55.88,12.7 FTX_A.1
N$17
  Top 0.254: T3.B 110.17,14.93 107.95,12.7 107.95,9.5 108.74,8.71 109.8,8.71 110.49,9.4 110.49,12.13 113.92,15.56 R8.2
N$18
  Top 0.762: R7.2 110.97,17.46 T3.C
N$19
  Top 0.762: T3.E 112.08,14.92 109.22,12.06 FTX_C.1
N$20
  Top 0.254: T4.B 136.68,16.51 138.75,16.51 R10.2
N$21
  Top 0.762: R9.2 133.5,17.61 T4.C
N$22
  Top 0.762: T4.E 137.47,14.29 135.89,12.7 FTX_D.1
N$23
  Top 0.254: FB3.2 FB2.1
N$27
  Top 0.254: R11.1 0.38,8.19 0.38,30.04 1.33,30.99 17.08,30.99 17.36,30.71 18.76,30.71 19.88,29.59 19.88,26.48 19.18,25.78 13.21,25.78 11.81,27.18 11.81,29.08 10.92,29.97 1.78,29.97 1.4,29.59 1.4,26.42 2.41,25.4 11.05,25.4 11.75,24.7 11.75,20.99 10.83,20.07 5.18,20.07 4.57,19.46 4.57,17.3 9.87,12 17.72,12 20.07,14.35 20.07,16.26 20.7,16.89 22.61,16.89 22.86,17.14 22.86,20.95 22.42,21.4 19.24,21.4 15.88,18.03 15.88,14.16 15.18,13.46 10.73,13.46 10.16,14.03 IC1.15
N$28
  Top 0.254: IC1.1 8.89,8.89 7.62,7.62 6.35,7.62 5.08,6.35 R12.1
N$29
  Top 0.254: 7.62,6.35 R13.1 10.16,8.57 IC1.2
N$30
  Top 0.254: R21.2 17.88,31.97 LED1V8.A
N$33
  Top 0.254: IC1.3 11.43,7.3 R14.1
N$34
  Top 0.254: IC1.4 R15.1
N$35
  Top 0.254: IC1.5 13.97,7.3 R16.1
N$36
  Top 0.254: IC1.6 15.24,8.57 R17.1
N$37
  Top 0.254: IC1.7 16.51,8.89 17.78,7.62 19.05,7.62 20.32,6.35 R18.1
N$38
  Top 0.254: R22.1 R19.2
N$39
  Top 0.254: R11.2 2.54,2.87 5.08,0.33 39.37,0.33 40.04,0.33 41,0.33 44.26,3.59 TXLED_A.A
N$40
  Top 0.254: RXLED_A.A 68.58,4.45 67.69,5.33 45.47,5.33 40.84,0.71 6.91,0.71 5.08,2.54 R12.2
N$41
  Top 0.254: R13.2 7.62,2.54 9.07,1.09 40.68,1.09 45.31,5.71 71.75,5.71 72.39,5.08 TXLED_B.A
N$42
  Top 0.254: R14.2 10.16,2.54 11.23,1.47 40.52,1.47 45.15,6.1 94.23,6.1 95.25,5.08 RXLED_B.A
N$43
  Top 0.254: R15.2 12.7,2.54 13.39,1.85 40.37,1.85 44.99,6.48 97.66,6.48 99.06,5.08 TXLED_C.A
N$44
  Top 0.254: R16.2 15.24,2.54 15.55,2.23 40.21,2.23 44.84,6.86 98.55,6.86 99.06,6.35 120.65,6.35 121.92,5.08 RXLED_C.A
N$45
  Top 0.254: R17.2 17.78,3.17 18.34,2.61 40.05,2.61 44.68,7.24 98.71,7.24 99.22,6.73 124.08,6.73 125.73,5.08 TXLED_D.A
N$46
  Top 0.254: R18.2 20.32,3.3 20.63,2.99 39.89,2.99 44.52,7.62 98.87,7.62 99.38,7.11 147.83,7.11 148.59,6.35 RXLED_D.A
N$47
  Top 0.254: R23.1 R22.2
N$48
  Top 0.254: R24.1 R25.1 R20.2
PWREN#
  Top 0.254: IC1.13 12.7,14.35 12.32,13.97 11.18,13.97 10.79,14.35 10.79,16.95 11.56,17.72 12.76,17.72 15.94,20.89 | U1.60 25.64,22.38 25.1,22.92 17.97,22.92 15.94,20.89 | R26.2 15.94,21.52 15.94,20.89
RXD_A
  Top 0.254: U1.17 38.41,20.38 38.87,20.84 40.64,20.84 59.2,20.84 61.34,18.7 61.34,17.78 | 58.42,9.65 FRX_A.4 58.42,12.06 61.34,14.99 61.34,17.78 | 61.34,17.78 64.77,17.78 66.04,16.51 FRX_A.1
RXD_B
  Top 0.254: U1.27 37.42,25.4 42.45,25.4 46.25,21.6 59.52,21.6 61.69,19.43 86.66,19.43 87.63,18.46 87.63,17.78 | 85.09,9.65 FRX_B.4 85.09,12.06 87.63,14.61 87.63,17.78 | FRX_B.1 92.71,16.51 91.44,17.78 87.63,17.78
RXD_C
  Top 0.254: U1.39 32.5,29.07 32.13,28.7 28.07,28.7 26.92,29.84 26.92,32.8 28.93,34.8 40.04,34.8 44.83,30 44.83,24.09 46.56,22.36 59.84,22.36 62.01,20.19 105.54,20.19 106.68,19.05 112.01,19.05 112.78,18.29 112.78,16.76 113.03,16.51 115.19,16.51 115.57,16.13 | FRX_C.4 111.76,12.06 113.67,13.97 114.94,13.97 115.57,14.61 115.57,16.13 | FRX_C.1 119.38,11.43 120.12,12.17 120.12,16.41 119.51,17.02 116.46,17.02 115.57,16.13
RXD_D
  Top 0.254: FRX_D.4 138.43,12.19 140.97,14.73 140.97,17.78 | 140.97,17.78 140.97,18.54 139.7,19.81 107,19.81 105.85,20.95 62.32,20.95 60.15,23.13 46.88,23.13 45.59,24.41 45.59,30.32 40.35,35.56 28.61,35.56 26.16,33.11 26.16,29.46 27.62,28 27.62,27.11 26.89,26.38 U1.52 | 140.97,17.78 144.78,17.78 146.05,16.51 FRX_D.1
TXD_A
  Top 0.254: R27.1 59.69,19.24 58.86,20.07 40.39,20.07 37.72,17.4 35.94,17.4 35.5,17.84 U1.16
TXD_B
  Top 0.254: R6.1 86.36,18.29 85.6,19.05 63.5,19.05 62.8,19.05 61.53,19.05 59.36,21.22 46.09,21.22 42.43,24.88 U1.26
TXD_C
  Top 0.254: U1.38 33,28.94 32.38,28.32 27.88,28.32 26.54,29.65 26.54,32.95 28.77,35.18 40.19,35.18 45.21,30.16 45.21,24.25 46.72,22.75 59.99,22.75 62.16,20.57 105.69,20.57 106.84,19.43 112.33,19.43 R8.1
TXD_D
  Top 0.254: R10.1 139.7,17.78 138.05,19.43 121.79,19.43 120.57,18.21 120.57,8.69 120.14,8.26 118.75,8.26 118.11,8.89 118.11,15.75 117.73,16.13 116.59,16.13 116.08,15.62 116.08,13.97 114.99,12.88 113.82,12.88 113.03,12.09 113.03,8.89 112.39,8.26 106.05,8.26 105.41,8.89 105.41,12.7 106.81,14.1 107.7,14.1 108.46,14.86 108.46,15.49 109.47,16.51 111.63,16.51 112.14,17.02 112.14,18.26 111.73,18.67 106.52,18.67 105.38,19.81 61.85,19.81 59.68,21.98 46.41,21.98 44.45,23.94 44.45,29.84 39.88,34.42 29.08,34.42 28,33.33 U1.48
VUSB
  Top 0.254: 44.58,8 44.36,8 39.73,3.38 23.93,3.38 22.23,5.08 22.23,7.75 18.86,11.11 9.46,11.11 3.56,17.02 3.56,19.81 4.7,20.95 9.53,20.95 10.16,21.59 R19.1 | 44.58,8 49.53,8 | 49.53,8 76.2,8 | C19.1 49.53,14.29 49.53,8 | C22.1 76.2,14.29 76.2,8 | C28.1 129.54,14.29 129.54,8.89 128.14,7.49 100.33,7.49 | 76.2,8 99.03,8 99.53,7.49 100.33,7.49 | C25.1 100.43,14.39 100.43,7.59 100.33,7.49 | VREG1.3 45.91,14.16 46.61,13.46 46.61,10.35 46.42,10.16 44.58,10.16 44.58,8
  Top 0.762: USB_TYPEB_FEMALE.1 33.07,12.26 38.42,12.26 C2.1 41.13,13.21 VREG1.3 | C19.1 C20.1 R28.1 | C22.1 C23.1 R5.1 | C25.1 C26.1 R7.1 | C28.1 C29.1 R9.1

### Text on the board
tPlace: 1V8 | R19-R25 100 | 3V3 | 4-Channel Fibre-Optic UART to USB Converter | VUSB | D | A | B | C | Q1 | RX_D | TX_B | TX_C | TX_D | TX_A | RX_A | RX_B | RX_C | R11-R18 1k
bPlace: 4-Channel Fibre-Optic UART to USB Converter